# Altium schematic sheet SD CARD .SchDoc
size 297 x 209 mm; SheetNumber: 19; SheetTotal: 29
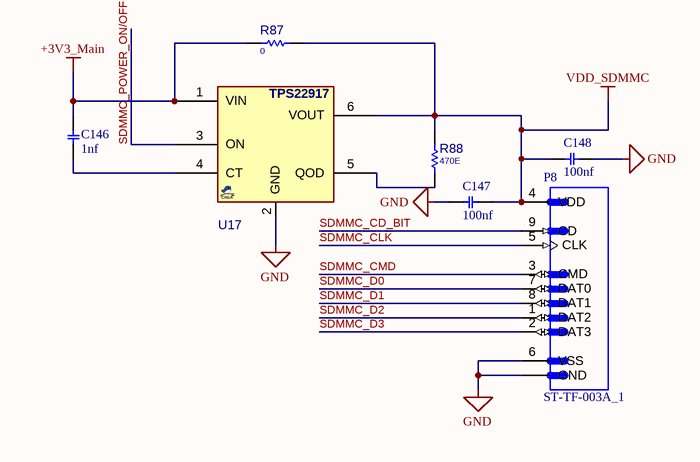
[diagram p0: SD CARD .SchDoc]

## Parts
C146  value 1nf  [C0603]  (hidden comment: Capacitor C SMD 0603)
C147  value 100nf  [C0603]  (hidden comment: Capacitor C SMD 0603)
C148  value 100nf  [C0603]  (hidden comment: Capacitor C SMD 0603)
P8  ST-TF-003A_1  [SUNTECH_ST-TF-003A]
R87  0  [R0603]
R88  470E  [R0603]
U17  TPS22917  [SOT23_6]  (value not drawn)

## Nets
+3V3_Main: C146.2 R87.1 U17.1(VIN)
GND: C147.2 C148.1 P8.6(VSS) P8.G1(GND) U17.2(GND)
VDD_SDMMC: C147.1 C148.2 P8.4(VDD) R87.2 R88.2 U17.6(VOUT)
SDMMC_CD_BIT: P8.9(CD)
SDMMC_CLK: P8.5(CLK)
SDMMC_CMD: P8.3(CMD)
SDMMC_D0: P8.7(DAT0)
SDMMC_D1: P8.8(DAT1)
SDMMC_D2: P8.1(DAT2)
SDMMC_D3: P8.2(DAT3)
SDMMC_POWER_ON/OFF: U17.3(ON)
NetC146_1: C146.1 U17.4(CT)
NetR88_1: R88.1 U17.5(QOD)

## Notes on the sheet
- Drawn
- Name
- Date
- Drawing Title
- Checked
- Drawing No.
- Approved
- Size
- A4
- Ver.
- Rev.
- Sheet
- Of

## Library data of the parts
P8 = ST-TF-003A_1: Micro SD Card Socket; Price: None; MP: ST-TF-003A; Availability: Unavailable; Value: *; Package: None
R87 R88 = RES_SMD_0603: RESISTOR, SMD; PARAM: -W; DESC: DESCRIPTION; DIST#: MOUSER; PARAM2: 1%; MANF_P#: -; MANF: -; ASSEMBLY: ASSEMBLY; PRICE: 100= 0.5$
  R87: VALUE: 0
  R88: VALUE: 470E
U17 = TPS22917_SOT23: LOAD SW, 2A, 1~5.5v, 80mOhm, SOT23; MANF: TI; MANF_P#: TPS22917DBV; PARAM: 2A, 1~5.5v, 80mOhm, -40~105oC; PRICE: 0.5$; VALUE: TPS22917
C146-C148 = Capacitor C SMD 0603: DatasheetVersion: 2021; ComponentLink1Description: Website Smart World; ComponentLink1URL: https://www.smartw.ir/; ComponentLink2Description: Telegram; ComponentLink2URL: https://t.me/altium_smartw; ComponentLink3Description: Instagram; ComponentLink3URL: https://Instagram.com/smartgw.ir